# Altium project MdFOC.PrjPcb
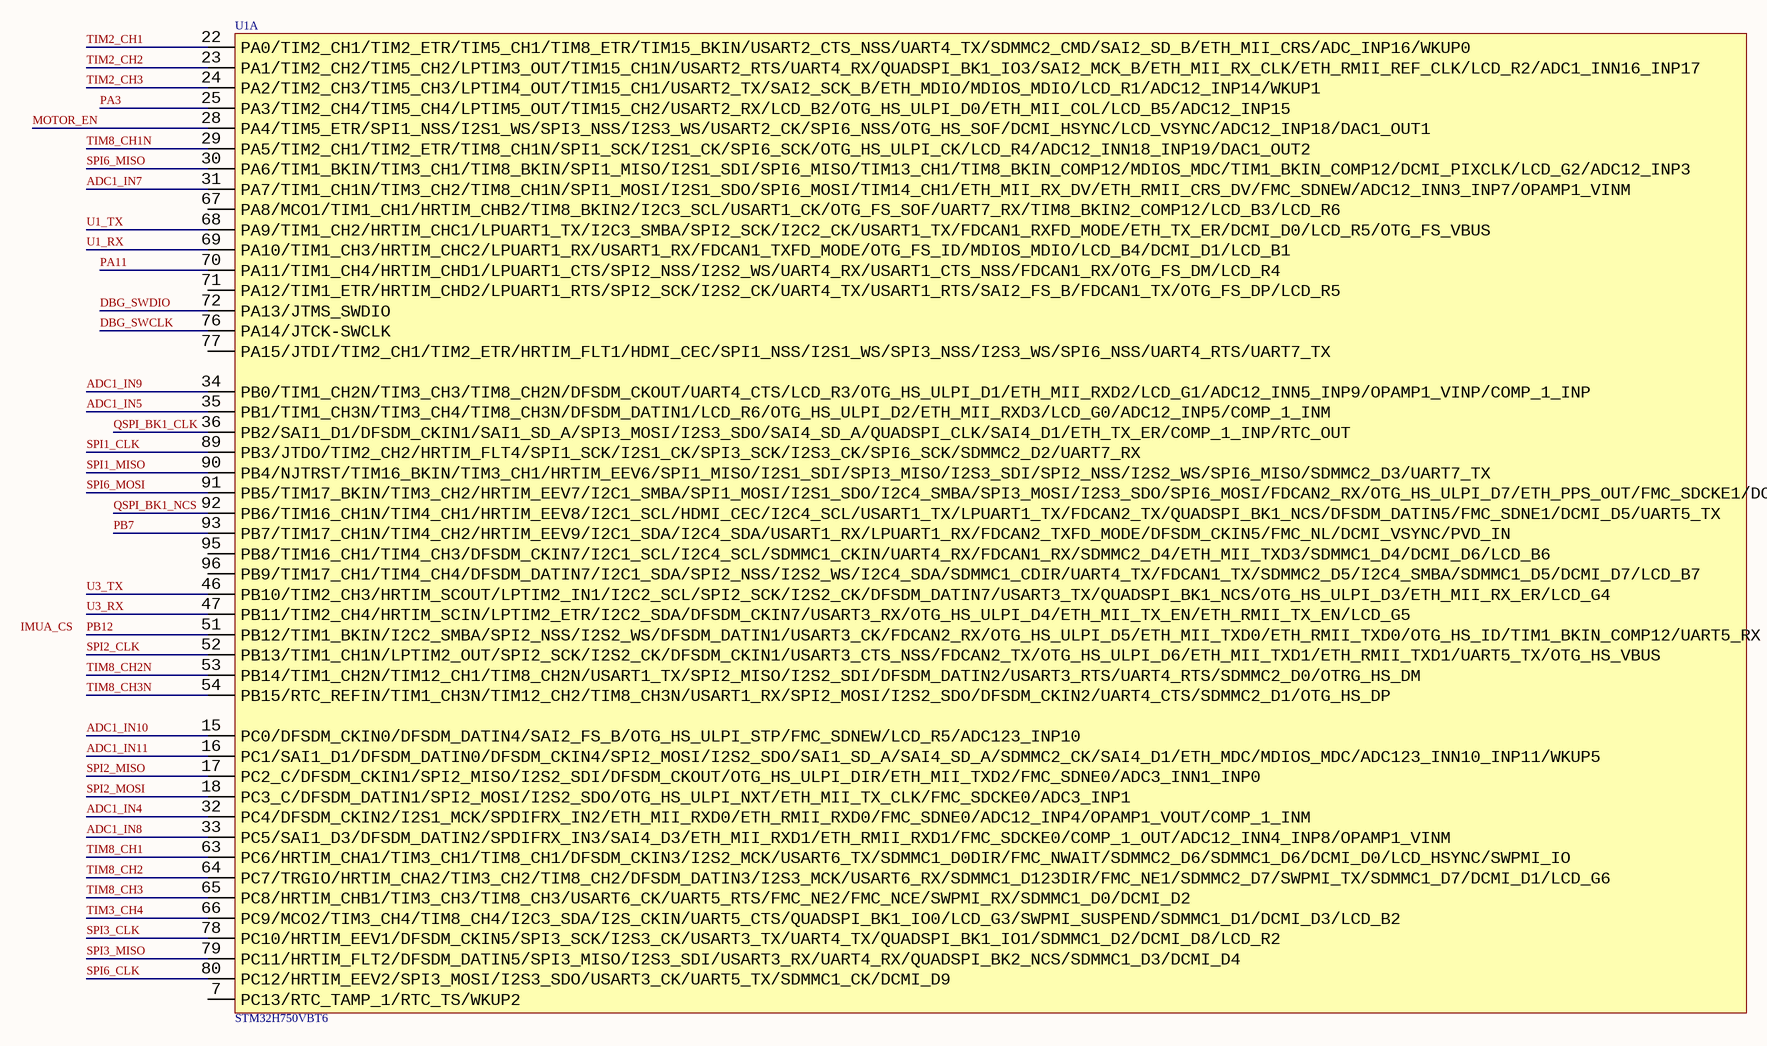
[diagram p0: MCU_A.SchDoc]
5 sheets, 195 parts. Net scope: global (net labels, ports and power ports of the same name join across sheets).
Board file: MdFOC.PcbDoc
Sheets:
  MCU_A.SchDoc
  MCU_B.SchDoc
  Motor.SchDoc
  Power.SchDoc
  Peripheral.SchDoc

## Sheet MCU_A.SchDoc
size A3; SheetNumber: 1; SheetTotal: 5

### Parts
U1  STM32H750VBT6  [LQFP100 14x14_L]  (part A of 3)

### Nets
ADC1_IN4: U1.32(PC4/DFSDM_CKIN2/I2S1_MCK/SPDIFRX_IN2/ETH_MII_RXD0/ETH_RMII_RXD0/FMC_SDNE0/ADC12_INP4/OPAMP1_VOUT/COMP_1_INM)  [project net 2A_ISENS]
ADC1_IN5: U1.35(PB1/TIM1_CH3N/TIM3_CH4/TIM8_CH3N/DFSDM_DATIN1/LCD_R6/OTG_HS_ULPI_D2/ETH_MII_RXD3/LCD_G0/ADC12_INP5/COMP_1_INM)  [project net 1A_ISENS]
ADC1_IN7: U1.31(PA7/TIM1_CH1N/TIM3_CH2/TIM8_CH1N/SPI1_MOSI/I2S1_SDO/SPI6_MOSI/TIM14_CH1/ETH_MII_RX_DV/ETH_RMII_CRS_DV/FMC_SDNEW/ADC12_INN3_INP7/OPAMP1_VINM)  [project net 3A_ISENS]
ADC1_IN8: U1.33(PC5/SAI1_D3/DFSDM_DATIN2/SPDIFRX_IN3/SAI4_D3/ETH_MII_RXD1/ETH_RMII_RXD1/FMC_SDCKE0/COMP_1_OUT/ADC12_INN4_INP8/OPAMP1_VINM)  [project net 2B_ISENS]
ADC1_IN9: U1.34(PB0/TIM1_CH2N/TIM3_CH3/TIM8_CH2N/DFSDM_CKOUT/UART4_CTS/LCD_R3/OTG_HS_ULPI_D1/ETH_MII_RXD2/LCD_G1/ADC12_INN5_INP9/OPAMP1_VINP/COMP_1_INP)  [project net 1B_ISENS]
ADC1_IN10: U1.15(PC0/DFSDM_CKIN0/DFSDM_DATIN4/SAI2_FS_B/OTG_HS_ULPI_STP/FMC_SDNEW/LCD_R5/ADC123_INP10)  [project net 3B_ISENS]
ADC1_IN11: U1.16(PC1/SAI1_D1/DFSDM_DATIN0/DFSDM_CKIN4/SPI2_MOSI/I2S2_SDO/SAI1_SD_A/SAI4_SD_A/SDMMC2_CK/SAI4_D1/ETH_MDC/MDIOS_MDC/ADC123_INN10_INP11/WKUP5)
DBG_SWCLK: U1.76(PA14/JTCK-SWCLK)
DBG_SWDIO: U1.72(PA13/JTMS_SWDIO)
MOTOR_EN: U1.28(PA4/TIM5_ETR/SPI1_NSS/I2S1_WS/SPI3_NSS/I2S3_WS/USART2_CK/SPI6_NSS/OTG_HS_SOF/DCMI_HSYNC/LCD_VSYNC/ADC12_INP18/DAC1_OUT1)
PA3: U1.25(PA3/TIM2_CH4/TIM5_CH4/LPTIM5_OUT/TIM15_CH2/USART2_RX/LCD_B2/OTG_HS_ULPI_D0/ETH_MII_COL/LCD_B5/ADC12_INP15)  [project net EC2_CS]
PA11: U1.70(PA11/TIM1_CH4/HRTIM_CHD1/LPUART1_CTS/SPI2_NSS/I2S2_WS/UART4_RX/USART1_CTS_NSS/FDCAN1_RX/OTG_FS_DM/LCD_R4)
PB7: U1.93(PB7/TIM17_CH1N/TIM4_CH2/HRTIM_EEV9/I2C1_SDA/I2C4_SDA/USART1_RX/LPUART1_RX/FDCAN2_TXFD_MODE/DFSDM_CKIN5/FMC_NL/DCMI_VSYNC/PVD_IN)
PB12: U1.51(PB12/TIM1_BKIN/I2C2_SMBA/SPI2_NSS/I2S2_WS/DFSDM_DATIN1/USART3_CK/FDCAN2_RX/OTG_HS_ULPI_D5/ETH_MII_TXD0/ETH_RMII_TXD0/OTG_HS_ID/TIM1_BKIN_COMP12/UART5_RX)  [project net IMU_CS]
QSPI_BK1_CLK: U1.36(PB2/SAI1_D1/DFSDM_CKIN1/SAI1_SD_A/SPI3_MOSI/I2S3_SDO/SAI4_SD_A/QUADSPI_CLK/SAI4_D1/ETH_TX_ER/COMP_1_INP/RTC_OUT)
QSPI_BK1_NCS: U1.92(PB6/TIM16_CH1N/TIM4_CH1/HRTIM_EEV8/I2C1_SCL/HDMI_CEC/I2C4_SCL/USART1_TX/LPUART1_TX/FDCAN2_TX/QUADSPI_BK1_NCS/DFSDM_DATIN5/FMC_SDNE1/DCMI_D5/UART5_TX)
SPI1_CLK: U1.89(PB3/JTDO/TIM2_CH2/HRTIM_FLT4/SPI1_SCK/I2S1_CK/SPI3_SCK/I2S3_CK/SPI6_SCK/SDMMC2_D2/UART7_RX)  [project net EC1_CLK]
SPI1_MISO: U1.90(PB4/NJTRST/TIM16_BKIN/TIM3_CH1/HRTIM_EEV6/SPI1_MISO/I2S1_SDI/SPI3_MISO/I2S3_SDI/SPI2_NSS/I2S2_WS/SPI6_MISO/SDMMC2_D3/UART7_TX)  [project net EC1_MISO]
SPI2_CLK: U1.52(PB13/TIM1_CH1N/LPTIM2_OUT/SPI2_SCK/I2S2_CK/DFSDM_CKIN1/USART3_CTS_NSS/FDCAN2_TX/OTG_HS_ULPI_D6/ETH_MII_TXD1/ETH_RMII_TXD1/UART5_TX/OTG_HS_VBUS)  [project net IMU_CLK]
SPI2_MISO: U1.17(PC2_C/DFSDM_CKIN1/SPI2_MISO/I2S2_SDI/DFSDM_CKOUT/OTG_HS_ULPI_DIR/ETH_MII_TXD2/FMC_SDNE0/ADC3_INN1_INP0)  [project net IMU_MISO]
SPI2_MOSI: U1.18(PC3_C/DFSDM_DATIN1/SPI2_MOSI/I2S2_SDO/OTG_HS_ULPI_NXT/ETH_MII_TX_CLK/FMC_SDCKE0/ADC3_INP1)  [project net IMU_MOSI]
SPI3_CLK: U1.78(PC10/HRTIM_EEV1/DFSDM_CKIN5/SPI3_SCK/I2S3_CK/USART3_TX/UART4_TX/QUADSPI_BK1_IO1/SDMMC1_D2/DCMI_D8/LCD_R2)  [project net SF_CLK]
SPI3_MISO: U1.79(PC11/HRTIM_FLT2/DFSDM_DATIN5/SPI3_MISO/I2S3_SDI/USART3_RX/UART4_RX/QUADSPI_BK2_NCS/SDMMC1_D3/DCMI_D4)  [project net SF_MISO]
SPI6_CLK: U1.80(PC12/HRTIM_EEV2/SPI3_MOSI/I2S3_SDO/USART3_CK/UART5_TX/SDMMC1_CK/DCMI_D9)
SPI6_MISO: U1.30(PA6/TIM1_BKIN/TIM3_CH1/TIM8_BKIN/SPI1_MISO/I2S1_SDI/SPI6_MISO/TIM13_CH1/TIM8_BKIN_COMP12/MDIOS_MDC/TIM1_BKIN_COMP12/DCMI_PIXCLK/LCD_G2/ADC12_INP3)
SPI6_MOSI: U1.91(PB5/TIM17_BKIN/TIM3_CH2/HRTIM_EEV7/I2C1_SMBA/SPI1_MOSI/I2S1_SDO/I2C4_SMBA/SPI3_MOSI/I2S3_SDO/SPI6_MOSI/FDCAN2_RX/OTG_HS_ULPI_D7/ETH_PPS_OUT/FMC_SDCKE1/DCMI_D10/UART5_RX)
TIM2_CH1: U1.22(PA0/TIM2_CH1/TIM2_ETR/TIM5_CH1/TIM8_ETR/TIM15_BKIN/USART2_CTS_NSS/UART4_TX/SDMMC2_CMD/SAI2_SD_B/ETH_MII_CRS/ADC_INP16/WKUP0)  [project net M3_PWMA]
TIM2_CH2: U1.23(PA1/TIM2_CH2/TIM5_CH2/LPTIM3_OUT/TIM15_CH1N/USART2_RTS/UART4_RX/QUADSPI_BK1_IO3/SAI2_MCK_B/ETH_MII_RX_CLK/ETH_RMII_REF_CLK/LCD_R2/ADC1_INN16_INP17)  [project net M3_PWMB]
TIM2_CH3: U1.24(PA2/TIM2_CH3/TIM5_CH3/LPTIM4_OUT/TIM15_CH1/USART2_TX/SAI2_SCK_B/ETH_MDIO/MDIOS_MDIO/LCD_R1/ADC12_INP14/WKUP1)  [project net M3_PWMC]
TIM3_CH4: U1.66(PC9/MCO2/TIM3_CH4/TIM8_CH4/I2C3_SDA/I2S_CKIN/UART5_CTS/QUADSPI_BK1_IO0/LCD_G3/SWPMI_SUSPEND/SDMMC1_D1/DCMI_D3/LCD_B2)  [project net BEEP_PWM]
TIM8_CH1: U1.63(PC6/HRTIM_CHA1/TIM3_CH1/TIM8_CH1/DFSDM_CKIN3/I2S2_MCK/USART6_TX/SDMMC1_D0DIR/FMC_NWAIT/SDMMC2_D6/SDMMC1_D6/DCMI_D0/LCD_HSYNC/SWPMI_IO)  [project net M1_PWMA]
TIM8_CH1N: U1.29(PA5/TIM2_CH1/TIM2_ETR/TIM8_CH1N/SPI1_SCK/I2S1_CK/SPI6_SCK/OTG_HS_ULPI_CK/LCD_R4/ADC12_INN18_INP19/DAC1_OUT2)  [project net M1_PWMA_N]
TIM8_CH2: U1.64(PC7/TRGIO/HRTIM_CHA2/TIM3_CH2/TIM8_CH2/DFSDM_DATIN3/I2S3_MCK/USART6_RX/SDMMC1_D123DIR/FMC_NE1/SDMMC2_D7/SWPMI_TX/SDMMC1_D7/DCMI_D1/LCD_G6)  [project net M1_PWMB]
TIM8_CH2N: U1.53(PB14/TIM1_CH2N/TIM12_CH1/TIM8_CH2N/USART1_TX/SPI2_MISO/I2S2_SDI/DFSDM_DATIN2/USART3_RTS/UART4_RTS/SDMMC2_D0/OTRG_HS_DM)  [project net M1_PWMB_N]
TIM8_CH3: U1.65(PC8/HRTIM_CHB1/TIM3_CH3/TIM8_CH3/USART6_CK/UART5_RTS/FMC_NE2/FMC_NCE/SWPMI_RX/SDMMC1_D0/DCMI_D2)  [project net M1_PWMC]
TIM8_CH3N: U1.54(PB15/RTC_REFIN/TIM1_CH3N/TIM12_CH2/TIM8_CH3N/USART1_RX/SPI2_MOSI/I2S2_SDO/DFSDM_CKIN2/UART4_CTS/SDMMC2_D1/OTG_HS_DP)  [project net M1_PWMC_N]
U1_RX: U1.69(PA10/TIM1_CH3/HRTIM_CHC2/LPUART1_RX/USART1_RX/FDCAN1_TXFD_MODE/OTG_FS_ID/MDIOS_MDIO/LCD_B4/DCMI_D1/LCD_B1)
U1_TX: U1.68(PA9/TIM1_CH2/HRTIM_CHC1/LPUART1_TX/I2C3_SMBA/SPI2_SCK/I2C2_CK/USART1_TX/FDCAN1_RXFD_MODE/ETH_TX_ER/DCMI_D0/LCD_R5/OTG_FS_VBUS)
U3_RX: U1.47(PB11/TIM2_CH4/HRTIM_SCIN/LPTIM2_ETR/I2C2_SDA/DFSDM_CKIN7/USART3_RX/OTG_HS_ULPI_D4/ETH_MII_TX_EN/ETH_RMII_TX_EN/LCD_G5)
U3_TX: U1.46(PB10/TIM2_CH3/HRTIM_SCOUT/LPTIM2_IN1/I2C2_SCL/SPI2_SCK/I2S2_CK/DFSDM_DATIN7/USART3_TX/QUADSPI_BK1_NCS/OTG_HS_ULPI_D3/ETH_MII_RX_ER/LCD_G4)

Not connected (* = marked no-connect by the designer): U1 7(PC13/RTC_TAMP_1/RTC_TS/WKUP2) 67(PA8/MCO1/TIM1_CH1/HRTIM_CHB2/TIM8_BKIN2/I2C3_SCL/USART1_CK/OTG_FS_SOF/UART7_RX/TIM8_BKIN2_COMP12/LCD_B3/LCD_R6) 71(PA12/TIM1_ETR/HRTIM_CHD2/LPUART1_RTS/SPI2_SCK/I2S2_CK/UART4_TX/USART1_RTS/SAI2_FS_B/FDCAN1_TX/OTG_FS_DP/LCD_R5) 77(PA15/JTDI/TIM2_CH1/TIM2_ETR/HRTIM_FLT1/HDMI_CEC/SPI1_NSS/I2S1_WS/SPI3_NSS/I2S3_WS/SPI6_NSS/UART4_RTS/UART7_TX) 95(PB8/TIM16_CH1/TIM4_CH3/DFSDM_CKIN7/I2C1_SCL/I2C4_SCL/SDMMC1_CKIN/UART4_RX/FDCAN1_RX/SDMMC2_D4/ETH_MII_TXD3/SDMMC1_D4/DCMI_D6/LCD_B6) 96(PB9/TIM17_CH1/TIM4_CH4/DFSDM_DATIN7/I2C1_SDA/SPI2_NSS/I2S2_WS/I2C4_SDA/SDMMC1_CDIR/UART4_TX/FDCAN1_TX/SDMMC2_D5/I2C4_SMBA/SDMMC1_D5/DCMI_D7/LCD_B7)

### Notes on the sheet
- IMUA_CS

## Sheet MCU_B.SchDoc
size A3; SheetNumber: 2; SheetTotal: 5
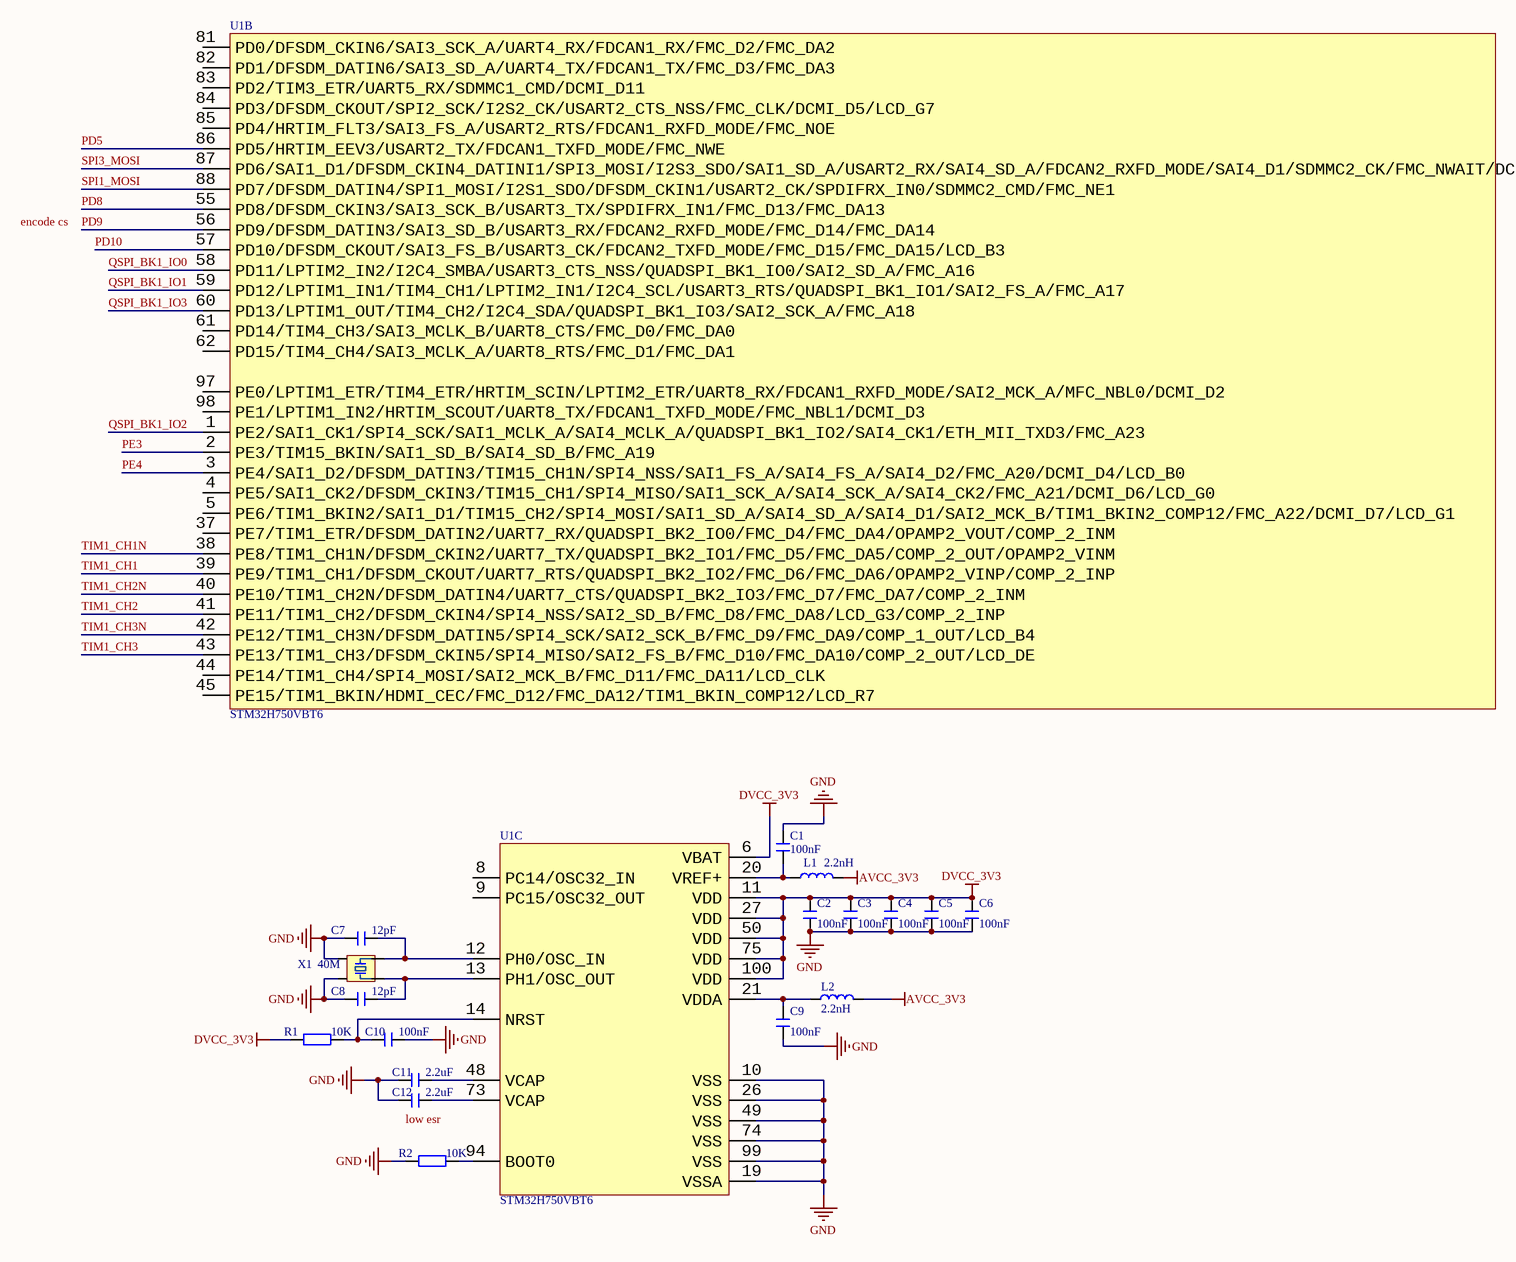
[diagram p1: MCU_B.SchDoc]

### Parts
C1  100nF  [C 0402_L]
C2  100nF  [C 0402_L]
C3  100nF  [C 0402_L]
C4  100nF  [C 0402_L]
C5  100nF  [C 0402_L]
C6  100nF  [C 0402_L]
C7  12pF  [C 0402_L]
C8  12pF  [C 0402_L]
C9  100nF  [C 0402_L]
C10  100nF  [C 0402_L]
C11  2.2uF  [C 0402_L]
C12  2.2uF  [C 0402_L]
L1  2.2nH  [L 0402]
L2  2.2nH  [L 0402]
R1  10K  [R 0402_L]
R2  10K  [R 0402_L]
U1  STM32H750VBT6  [LQFP100 14x14_L]  (parts B,C of 3)
X1  40M  [OSC 2016-4P]

### Nets
AVCC_3V3: L1.2 L2.2
DVCC_3V3: C2.2 C3.2 C4.2 C5.2 C6.2 R1.1 U1.6(VBAT) U1.11(VDD) U1.27(VDD) U1.50(VDD) U1.75(VDD) U1.100(VDD)
GND: C1.2 C2.1 C3.1 C4.1 C5.1 C6.1 C7.1 C8.1 C9.1 C10.2 C11.1 C12.1 R2.1 U1.10(VSS) U1.19(VSSA) U1.26(VSS) U1.49(VSS) U1.74(VSS) U1.99(VSS) X1.2 X1.4
PD5: U1.86(PD5/HRTIM_EEV3/USART2_TX/FDCAN1_TXFD_MODE/FMC_NWE)
PD8: U1.55(PD8/DFSDM_CKIN3/SAI3_SCK_B/USART3_TX/SPDIFRX_IN1/FMC_D13/FMC_DA13)  [project net IMUB_CS]
PD9: U1.56(PD9/DFSDM_DATIN3/SAI3_SD_B/USART3_RX/FDCAN2_RXFD_MODE/FMC_D14/FMC_DA14)  [project net EC1_CS]
PD10: U1.57(PD10/DFSDM_CKOUT/SAI3_FS_B/USART3_CK/FDCAN2_TXFD_MODE/FMC_D15/FMC_DA15/LCD_B3)  [project net EC3_CS]
PE3: U1.2(PE3/TIM15_BKIN/SAI1_SD_B/SAI4_SD_B/FMC_A19)
PE4: U1.3(PE4/SAI1_D2/DFSDM_DATIN3/TIM15_CH1N/SPI4_NSS/SAI1_FS_A/SAI4_FS_A/SAI4_D2/FMC_A20/DCMI_D4/LCD_B0)
QSPI_BK1_IO0: U1.58(PD11/LPTIM2_IN2/I2C4_SMBA/USART3_CTS_NSS/QUADSPI_BK1_IO0/SAI2_SD_A/FMC_A16)
QSPI_BK1_IO1: U1.59(PD12/LPTIM1_IN1/TIM4_CH1/LPTIM2_IN1/I2C4_SCL/USART3_RTS/QUADSPI_BK1_IO1/SAI2_FS_A/FMC_A17)
QSPI_BK1_IO2: U1.1(PE2/SAI1_CK1/SPI4_SCK/SAI1_MCLK_A/SAI4_MCLK_A/QUADSPI_BK1_IO2/SAI4_CK1/ETH_MII_TXD3/FMC_A23)
QSPI_BK1_IO3: U1.60(PD13/LPTIM1_OUT/TIM4_CH2/I2C4_SDA/QUADSPI_BK1_IO3/SAI2_SCK_A/FMC_A18)
SPI1_MOSI: U1.88(PD7/DFSDM_DATIN4/SPI1_MOSI/I2S1_SDO/DFSDM_CKIN1/USART2_CK/SPDIFRX_IN0/SDMMC2_CMD/FMC_NE1)  [project net EC1_MOSI]
SPI3_MOSI: U1.87(PD6/SAI1_D1/DFSDM_CKIN4_DATINI1/SPI3_MOSI/I2S3_SDO/SAI1_SD_A/USART2_RX/SAI4_SD_A/FDCAN2_RXFD_MODE/SAI4_D1/SDMMC2_CK/FMC_NWAIT/DCMI_D10/LCD_B2)  [project net SF_MOSI]
TIM1_CH1: U1.39(PE9/TIM1_CH1/DFSDM_CKOUT/UART7_RTS/QUADSPI_BK2_IO2/FMC_D6/FMC_DA6/OPAMP2_VINP/COMP_2_INP)  [project net M2_PWMA]
TIM1_CH1N: U1.38(PE8/TIM1_CH1N/DFSDM_CKIN2/UART7_TX/QUADSPI_BK2_IO1/FMC_D5/FMC_DA5/COMP_2_OUT/OPAMP2_VINM)  [project net M2_PWMA_N]
TIM1_CH2: U1.41(PE11/TIM1_CH2/DFSDM_CKIN4/SPI4_NSS/SAI2_SD_B/FMC_D8/FMC_DA8/LCD_G3/COMP_2_INP)  [project net M2_PWMB]
TIM1_CH2N: U1.40(PE10/TIM1_CH2N/DFSDM_DATIN4/UART7_CTS/QUADSPI_BK2_IO3/FMC_D7/FMC_DA7/COMP_2_INM)  [project net M2_PWMB_N]
TIM1_CH3: U1.43(PE13/TIM1_CH3/DFSDM_CKIN5/SPI4_MISO/SAI2_FS_B/FMC_D10/FMC_DA10/COMP_2_OUT/LCD_DE)  [project net M2_PWMC]
TIM1_CH3N: U1.42(PE12/TIM1_CH3N/DFSDM_DATIN5/SPI4_SCK/SAI2_SCK_B/FMC_D9/FMC_DA9/COMP_1_OUT/LCD_B4)  [project net M2_PWMC_N]
NetC1_1: C1.1 L1.1 U1.20(VREF+)
NetC7_2: C7.2 U1.12(PH0/OSC_IN) X1.1
NetC8_2: C8.2 U1.13(PH1/OSC_OUT) X1.3
NetC9_2: C9.2 L2.1 U1.21(VDDA)
NetC10_1: C10.1 R1.2 U1.14(NRST)
NetC11_2: C11.2 U1.48(VCAP)
NetC12_2: C12.2 U1.73(VCAP)
NetR2_2: R2.2 U1.94(BOOT0)

Not connected (* = marked no-connect by the designer): U1 4(PE5/SAI1_CK2/DFSDM_CKIN3/TIM15_CH1/SPI4_MISO/SAI1_SCK_A/SAI4_SCK_A/SAI4_CK2/FMC_A21/DCMI_D6/LCD_G0) 5(PE6/TIM1_BKIN2/SAI1_D1/TIM15_CH2/SPI4_MOSI/SAI1_SD_A/SAI4_SD_A/SAI4_D1/SAI2_MCK_B/TIM1_BKIN2_COMP12/FMC_A22/DCMI_D7/LCD_G1) 8(PC14/OSC32_IN) 9(PC15/OSC32_OUT) 37(PE7/TIM1_ETR/DFSDM_DATIN2/UART7_RX/QUADSPI_BK2_IO0/FMC_D4/FMC_DA4/OPAMP2_VOUT/COMP_2_INM) 44(PE14/TIM1_CH4/SPI4_MOSI/SAI2_MCK_B/FMC_D11/FMC_DA11/LCD_CLK) 45(PE15/TIM1_BKIN/HDMI_CEC/FMC_D12/FMC_DA12/TIM1_BKIN_COMP12/LCD_R7) 61(PD14/TIM4_CH3/SAI3_MCLK_B/UART8_CTS/FMC_D0/FMC_DA0) 62(PD15/TIM4_CH4/SAI3_MCLK_A/UART8_RTS/FMC_D1/FMC_DA1) 81(PD0/DFSDM_CKIN6/SAI3_SCK_A/UART4_RX/FDCAN1_RX/FMC_D2/FMC_DA2) 82(PD1/DFSDM_DATIN6/SAI3_SD_A/UART4_TX/FDCAN1_TX/FMC_D3/FMC_DA3) 83(PD2/TIM3_ETR/UART5_RX/SDMMC1_CMD/DCMI_D11) 84(PD3/DFSDM_CKOUT/SPI2_SCK/I2S2_CK/USART2_CTS_NSS/FMC_CLK/DCMI_D5/LCD_G7) 85(PD4/HRTIM_FLT3/SAI3_FS_A/USART2_RTS/FDCAN1_RXFD_MODE/FMC_NOE) 97(PE0/LPTIM1_ETR/TIM4_ETR/HRTIM_SCIN/LPTIM2_ETR/UART8_RX/FDCAN1_RXFD_MODE/SAI2_MCK_A/MFC_NBL0/DCMI_D2) 98(PE1/LPTIM1_IN2/HRTIM_SCOUT/UART8_TX/FDCAN1_TXFD_MODE/FMC_NBL1/DCMI_D3)

### Notes on the sheet
- encode cs
- (near C12) low esr

### Library data of the parts
C1-C12 = C: 无极性贴片电容; 版权归属: 源创客; BOM名称: 无极性贴片电容; 学习资源: www.ooocke.com
L1 L2 = L: 小功率贴片电感; 版权归属: 源创客; BOM名称: 小功率贴片电感; 学习资源: www.ooocke.com
R1 R2 = R: 贴片电阻; 版权归属: 源创客; BOM名称: 贴片电阻; 学习资源: www.ooocke.com
X1 = XTAL-4P: 4脚无源晶振; 版权归属: 源创客; BOM名称: 4脚无源晶振; 学习资源: www.ooocke.com

## Sheet Motor.SchDoc
size A3; SheetNumber: 3; SheetTotal: 5
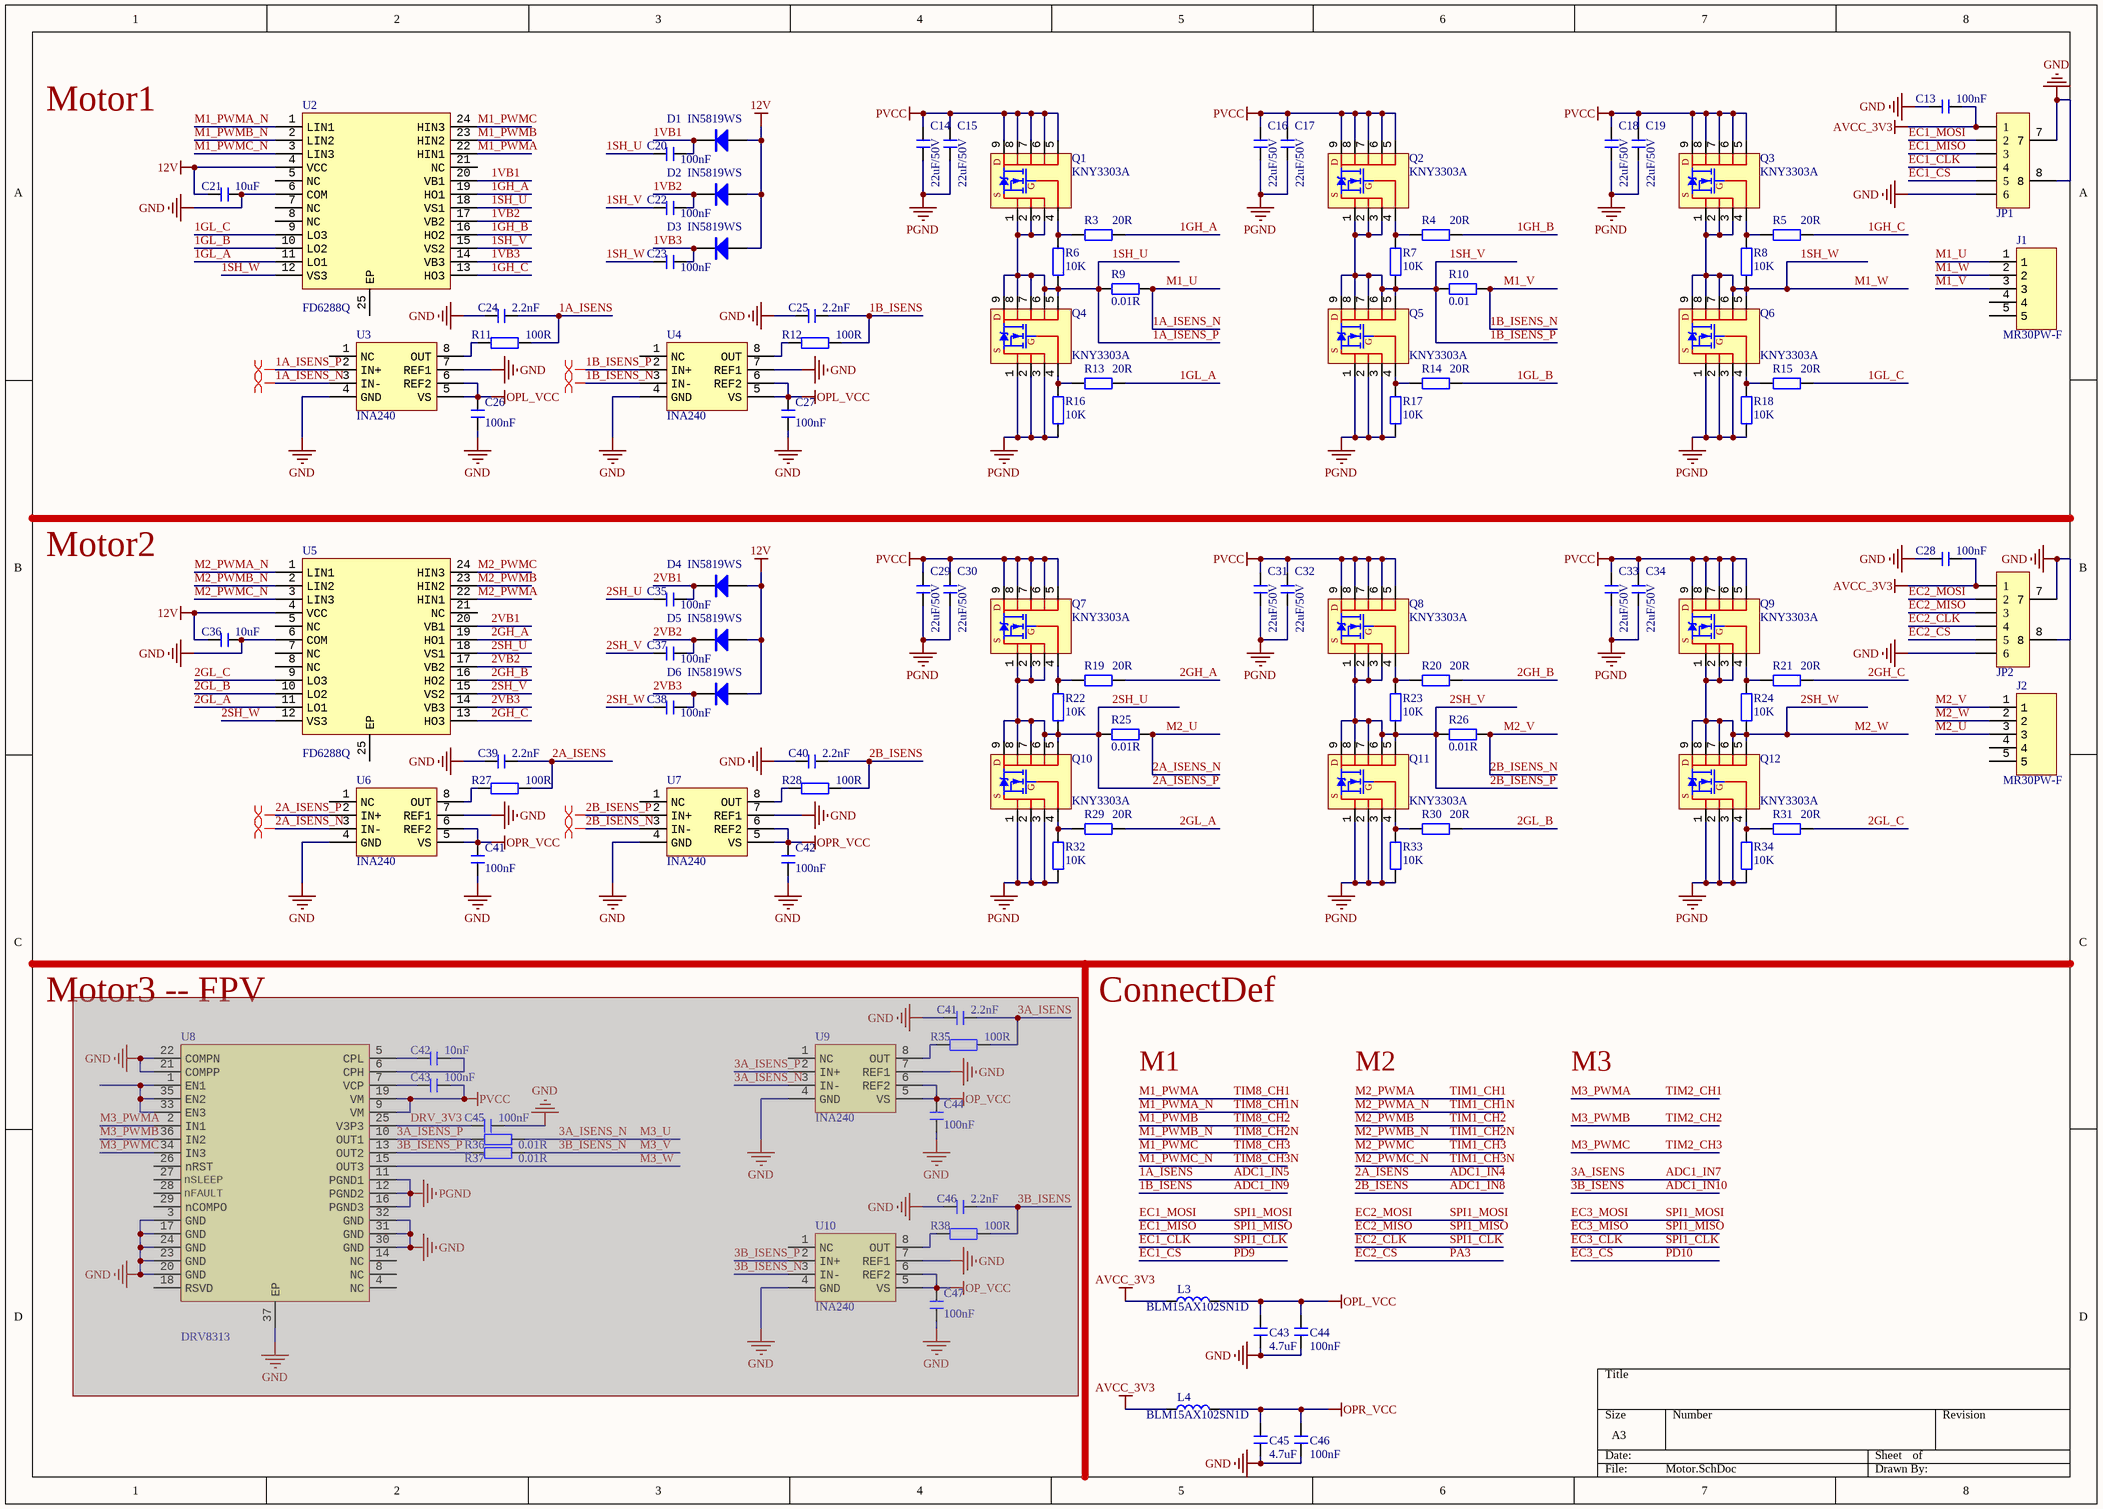
[diagram p2: Motor.SchDoc]

### Parts
(Parts that share a designator on the sheet are numbered #1, #2 ... from top to bottom, then left to right.)
C13  100nF  [C 0402_L]
C14  22uF/50V  [C 1206_L]
C15  22uF/50V  [C 1206_L]
C16  22uF/50V  [C 1206_L]
C17  22uF/50V  [C 1206_L]
C18  22uF/50V  [C 1206_L]
C19  22uF/50V  [C 1206_L]
C20  100nF  [C 0402_L]
C21  10uF  [C 0603_L]
C22  100nF  [C 0402_L]
C23  100nF  [C 0402_L]
C24  2.2nF  [C 0402_L]
C25  2.2nF  [C 0402_L]
C26  100nF  [C 0402_L]
C27  100nF  [C 0402_L]
C28  100nF  [C 0402_L]
C29  22uF/50V  [C 1206_L]
C30  22uF/50V  [C 1206_L]
C31  22uF/50V  [C 1206_L]
C32  22uF/50V  [C 1206_L]
C33  22uF/50V  [C 1206_L]
C34  22uF/50V  [C 1206_L]
C35  100nF  [C 0402_L]
C36  10uF  [C 0603_L]
C37  100nF  [C 0402_L]
C38  100nF  [C 0402_L]
C39  2.2nF  [C 0402_L]
C40  2.2nF  [C 0402_L]
C41#1  100nF  [C 0402_L]
C41#2  2.2nF  [C 0402_L]  (masked out: inside a compile mask, not in the netlist)
C42#1  100nF  [C 0402_L]
C42#2  10nF  [C 0402_L]  (masked out: inside a compile mask, not in the netlist)
C43#1  100nF  [C 0402_L]  (masked out: inside a compile mask, not in the netlist)
C43#2  4.7uF  [C 0402_L]
C44#1  100nF  [C 0402_L]  (masked out: inside a compile mask, not in the netlist)
C44#2  100nF  [C 0402_L]
C45#1  100nF  [C 0402_L]  (masked out: inside a compile mask, not in the netlist)
C45#2  4.7uF  [C 0402_L]
C46#1  2.2nF  [C 0402_L]  (masked out: inside a compile mask, not in the netlist)
C46#2  100nF  [C 0402_L]
C47#1  100nF  [C 0402_L]  (masked out: inside a compile mask, not in the netlist)
D1  IN5819WS  [SOD-323]
D2  IN5819WS  [SOD-323]
D3  IN5819WS  [SOD-323]
D4  IN5819WS  [SOD-323]
D5  IN5819WS  [SOD-323]
D6  IN5819WS  [SOD-323]
J1  MR30PW-F  [MR30PW_F]
J2  MR30PW-F  [MR30PW_F]
JP1  HDR-1X6  [GH1.25-WS-6P]  (value not drawn)
JP2  HDR-1X6  [GH1.25-WS-6P]  (value not drawn)
L3  BLM15AX102SN1D  [L 0402]
L4  BLM15AX102SN1D  [L 0402]
Q1  KNY3303A  [PDFN-8(5.8x4.9)]
Q2  KNY3303A  [PDFN-8(5.8x4.9)]
Q3  KNY3303A  [PDFN-8(5.8x4.9)]
Q4  KNY3303A  [PDFN-8(5.8x4.9)]
Q5  KNY3303A  [PDFN-8(5.8x4.9)]
Q6  KNY3303A  [PDFN-8(5.8x4.9)]
Q7  KNY3303A  [PDFN-8(5.8x4.9)]
Q8  KNY3303A  [PDFN-8(5.8x4.9)]
Q9  KNY3303A  [PDFN-8(5.8x4.9)]
Q10  KNY3303A  [PDFN-8(5.8x4.9)]
Q11  KNY3303A  [PDFN-8(5.8x4.9)]
Q12  KNY3303A  [PDFN-8(5.8x4.9)]
R3  20R  [R 0402_L]
R4  20R  [R 0402_L]
R5  20R  [R 0402_L]
R6  10K  [R 0402_L]
R7  10K  [R 0402_L]
R8  10K  [R 0402_L]
R9  0.01R  [R 2512_L]
R10  0.01  [R 2512_L]
R11  100R  [R 0402_L]
R12  100R  [R 0402_L]
R13  20R  [R 0402_L]
R14  20R  [R 0402_L]
R15  20R  [R 0402_L]
R16  10K  [R 0402_L]
R17  10K  [R 0402_L]
R18  10K  [R 0402_L]
R19  20R  [R 0402_L]
R20  20R  [R 0402_L]
R21  20R  [R 0402_L]
R22  10K  [R 0402_L]
R23  10K  [R 0402_L]
R24  10K  [R 0402_L]
R25  0.01R  [R 2512_L]
R26  0.01R  [R 2512_L]
R27  100R  [R 0402_L]
R28  100R  [R 0402_L]
R29  20R  [R 0402_L]
R30  20R  [R 0402_L]
R31  20R  [R 0402_L]
R32  10K  [R 0402_L]
R33  10K  [R 0402_L]
R34  10K  [R 0402_L]
R35#1  100R  [R 0402_L]  (masked out: inside a compile mask, not in the netlist)
R36#1  0.01R  [RI 1206]  (masked out: inside a compile mask, not in the netlist)
R37#1  0.01R  [RI 1206]  (masked out: inside a compile mask, not in the netlist)
R38#1  100R  [R 0402_L]  (masked out: inside a compile mask, not in the netlist)
U2  FD6288Q  [QFN24 4x4_L]
U3  INA240  [SSOP8_L]
U4  INA240  [SSOP8_L]
U5  FD6288Q  [QFN24 4x4_L]
U6  INA240  [SSOP8_L]
U7  INA240  [SSOP8_L]
U8#1  DRV8313  [VQFN-36-6X6]  (masked out: inside a compile mask, not in the netlist)
U9#1  INA240  [SSOP8_L]  (masked out: inside a compile mask, not in the netlist)
U10#1  INA240  [SSOP8_L]  (masked out: inside a compile mask, not in the netlist)

### Nets
12V: C21.1 C36.1 D1.2(K) D2.2(K) D3.2(K) D4.2(K) D5.2(K) D6.2(K) U2.4(VCC) U5.4(VCC)
AVCC_3V3: C13.2 C28.2 JP1.1 JP2.1 L3.1 L4.1
GND: C13.1 C21.2 C24.1 C25.1 C26.1 C27.1 C28.1 C36.2 C39.1 C40.1 C41#1.1 C42#1.1 C43#2.1 C44#2.1 C45#2.1 C46#2.1 JP1.6 JP1.7 JP1.8 JP2.6 JP2.7 JP2.8 U2.6(COM) U3.4(GND) U3.7(REF1) U4.4(GND) U4.7(REF1) U5.6(COM) U6.4(GND) U6.7(REF1) U7.4(GND) U7.7(REF1)
OPL_VCC: C26.2 C27.2 C43#2.2 C44#2.2 L3.2 U3.5(VS) U3.6(REF2) U4.5(VS) U4.6(REF2)
OPR_VCC: C41#1.2 C42#1.2 C45#2.2 C46#2.2 L4.2 U6.5(VS) U6.6(REF2) U7.5(VS) U7.6(REF2)
PGND: C14.1 C15.1 C16.1 C17.1 C18.1 C19.1 C29.1 C30.1 C31.1 C32.1 C33.1 C34.1 Q4.1(S) Q4.2(S) Q4.3(S) Q5.1(S) Q5.2(S) Q5.3(S) Q6.1(S) Q6.2(S) Q6.3(S) Q10.1(S) Q10.2(S) Q10.3(S) Q11.1(S) Q11.2(S) Q11.3(S) Q12.1(S) Q12.2(S) Q12.3(S) R16.1 R17.1 R18.1 R32.1 R33.1 R34.1
PVCC: C14.2 C15.2 C16.2 C17.2 C18.2 C19.2 C29.2 C30.2 C31.2 C32.2 C33.2 C34.2 Q1.5(D) Q1.6(D) Q1.7(D) Q1.8(D) Q1.9(D) Q2.5(D) Q2.6(D) Q2.7(D) Q2.8(D) Q2.9(D) Q3.5(D) Q3.6(D) Q3.7(D) Q3.8(D) Q3.9(D) Q7.5(D) Q7.6(D) Q7.7(D) Q7.8(D) Q7.9(D) Q8.5(D) Q8.6(D) Q8.7(D) Q8.8(D) Q8.9(D) Q9.5(D) Q9.6(D) Q9.7(D) Q9.8(D) Q9.9(D)
1A_ISENS: C24.2 R11.2  [also labelled ADC1_IN5]
1A_ISENS_N: J1.1 R9.2 U3.3(IN-)  [also labelled M1_U]
1A_ISENS_P: C20.1 Q1.1(S) Q1.2(S) Q1.3(S) Q4.5(D) Q4.6(D) Q4.7(D) Q4.8(D) Q4.9(D) R6.1 R9.1 U2.18(VS1) U3.2(IN+)  [also labelled 1SH_U]
1B_ISENS: C25.2 R12.2  [also labelled ADC1_IN9]
1B_ISENS_N: J1.3 R10.2 U4.3(IN-)  [also labelled M1_V]
1B_ISENS_P: C22.1 Q2.1(S) Q2.2(S) Q2.3(S) Q5.5(D) Q5.6(D) Q5.7(D) Q5.8(D) Q5.9(D) R7.1 R10.1 U2.15(VS2) U4.2(IN+)  [also labelled 1SH_V]
1GH_A: R3.2 U2.19(HO1)
1GH_B: R4.2 U2.16(HO2)
1GH_C: R5.2 U2.13(HO3)
1GL_A: R13.2 U2.11(LO1)
1GL_B: R14.2 U2.10(LO2)
1GL_C: R15.2 U2.9(LO3)
1SH_W: C23.1 J1.2 Q3.1(S) Q3.2(S) Q3.3(S) Q6.5(D) Q6.6(D) Q6.7(D) Q6.8(D) Q6.9(D) R8.1 U2.12(VS3)  [also labelled M1_W]
1VB1: C20.2 D1.1(A) U2.20(VB1)
1VB2: C22.2 D2.1(A) U2.17(VB2)
1VB3: C23.2 D3.1(A) U2.14(VB3)
2A_ISENS: C39.2 R27.2  [also labelled ADC1_IN4]
2A_ISENS_N: J2.3 R25.2 U6.3(IN-)  [also labelled M2_U]
2A_ISENS_P: C35.1 Q7.1(S) Q7.2(S) Q7.3(S) Q10.5(D) Q10.6(D) Q10.7(D) Q10.8(D) Q10.9(D) R22.1 R25.1 U5.18(VS1) U6.2(IN+)  [also labelled 2SH_U]
2B_ISENS: C40.2 R28.2  [also labelled ADC1_IN8]
2B_ISENS_N: J2.1 R26.2 U7.3(IN-)  [also labelled M2_V]
2B_ISENS_P: C37.1 Q8.1(S) Q8.2(S) Q8.3(S) Q11.5(D) Q11.6(D) Q11.7(D) Q11.8(D) Q11.9(D) R23.1 R26.1 U5.15(VS2) U7.2(IN+)  [also labelled 2SH_V]
2GH_A: R19.2 U5.19(HO1)
2GH_B: R20.2 U5.16(HO2)
2GH_C: R21.2 U5.13(HO3)
2GL_A: R29.2 U5.11(LO1)
2GL_B: R30.2 U5.10(LO2)
2GL_C: R31.2 U5.9(LO3)
2SH_W: C38.1 J2.2 Q9.1(S) Q9.2(S) Q9.3(S) Q12.5(D) Q12.6(D) Q12.7(D) Q12.8(D) Q12.9(D) R24.1 U5.12(VS3)  [also labelled M2_W]
2VB1: C35.2 D4.1(A) U5.20(VB1)
2VB2: C37.2 D5.1(A) U5.17(VB2)
2VB3: C38.2 D6.1(A) U5.14(VB3)
EC1_CLK: JP1.4 JP2.4  [also labelled EC2_CLK, EC3_CLK, SPI1_CLK]
EC1_CS: JP1.5  [also labelled PD9]
EC1_MISO: JP1.3 JP2.3  [also labelled EC2_MISO, EC3_MISO, SPI1_MISO]
EC1_MOSI: JP1.2 JP2.2  [also labelled EC2_MOSI, EC3_MOSI, SPI1_MOSI]
EC2_CS: JP2.5  [also labelled PA3]
M1_PWMA: U2.22(HIN1)  [also labelled TIM8_CH1]
M1_PWMA_N: U2.1(LIN1)  [also labelled TIM8_CH1N]
M1_PWMB: U2.23(HIN2)  [also labelled TIM8_CH2]
M1_PWMB_N: U2.2(LIN2)  [also labelled TIM8_CH2N]
M1_PWMC: U2.24(HIN3)  [also labelled TIM8_CH3]
M1_PWMC_N: U2.3(LIN3)  [also labelled TIM8_CH3N]
M2_PWMA: U5.22(HIN1)  [also labelled TIM1_CH1]
M2_PWMA_N: U5.1(LIN1)  [also labelled TIM1_CH1N]
M2_PWMB: U5.23(HIN2)  [also labelled TIM1_CH2]
M2_PWMB_N: U5.2(LIN2)  [also labelled TIM1_CH2N]
M2_PWMC: U5.24(HIN3)  [also labelled TIM1_CH3]
M2_PWMC_N: U5.3(LIN3)  [also labelled TIM1_CH3N]
NetQ1_4: Q1.4(G) R3.1 R6.2
NetQ2_4: Q2.4(G) R4.1 R7.2
NetQ3_4: Q3.4(G) R5.1 R8.2
NetQ4_4: Q4.4(G) R13.1 R16.2
NetQ5_4: Q5.4(G) R14.1 R17.2
NetQ6_4: Q6.4(G) R15.1 R18.2
NetQ7_4: Q7.4(G) R19.1 R22.2
NetQ8_4: Q8.4(G) R20.1 R23.2
NetQ9_4: Q9.4(G) R21.1 R24.2
NetQ10_4: Q10.4(G) R29.1 R32.2
NetQ11_4: Q11.4(G) R30.1 R33.2
NetQ12_4: Q12.4(G) R31.1 R34.2
NetR11_1: R11.1 U3.8(OUT)
NetR12_1: R12.1 U4.8(OUT)
NetR27_1: R27.1 U6.8(OUT)
NetR28_1: R28.1 U7.8(OUT)

Not connected (* = marked no-connect by the designer): J1 4 5; J2 4 5; U2 5(NC) 7(NC) 8(NC) 21(NC) 25(EP); U3 1(NC); U4 1(NC); U5 5(NC) 7(NC) 8(NC) 21(NC) 25(EP); U6 1(NC); U7 1(NC)

### Layout directives
differential pair: 1A_ISENS_N, 1A_ISENS_P, 1B_ISENS_N, 1B_ISENS_P, 2A_ISENS_N, 2A_ISENS_P, 2B_ISENS_N, 2B_ISENS_P

### Notes on the sheet
- Motor1
- Motor2
- (near U8#1) Motor3 -- FPV
- ConnectDef
- M1
- M2
- M3

### Library data of the parts
C13-C40 C41#1 C41#2 C42#1 C42#2 C43#1 C43#2 C44#1 C44#2 C45#1 C45#2 C46#1 C46#2 C47#1 = C: 无极性贴片电容; 版权归属: 源创客; BOM名称: 无极性贴片电容; 学习资源: www.ooocke.com
D1-D6 = 1N5819: 肖特基二极管; 版权归属: 源创客; 属性: 40V/2A; BOM名称: 肖特基二极管; 学习资源: www.ooocke.com
J1 J2 = MR30PW-F: 航模接口
JP1 JP2 = Header 6: 6P接插件; 版权归属: 源创客; BOM名称: 6P接插件; 学习资源: www.ooocke.com
L3 L4 = L: 小功率贴片电感; 版权归属: 源创客; BOM名称: 小功率贴片电感; 学习资源: www.ooocke.com
Q1-Q12 = KNY3303A: N沟道MOS管 / PDFN-8(5.8x4.9)
R3-R34 R35#1 R38#1 = R: 贴片电阻; 版权归属: 源创客; BOM名称: 贴片电阻; 学习资源: www.ooocke.com
R36#1 R37#1 = R-I: 电流检测电阻; 版权归属: 源创客; BOM名称: 电流检测电阻; 学习资源: www.ooocke.com
U2 U5 = FD6288Q: 栅极驱动IC
U3 U4 U6 U7 U9#1 U10#1 = INA240: PWM抑制电流检测芯片
U8#1 = DRV8313: 集成FET的3路半桥驱动器 / 3A

## Sheet Power.SchDoc
size A4; SheetNumber: 4; SheetTotal: 5
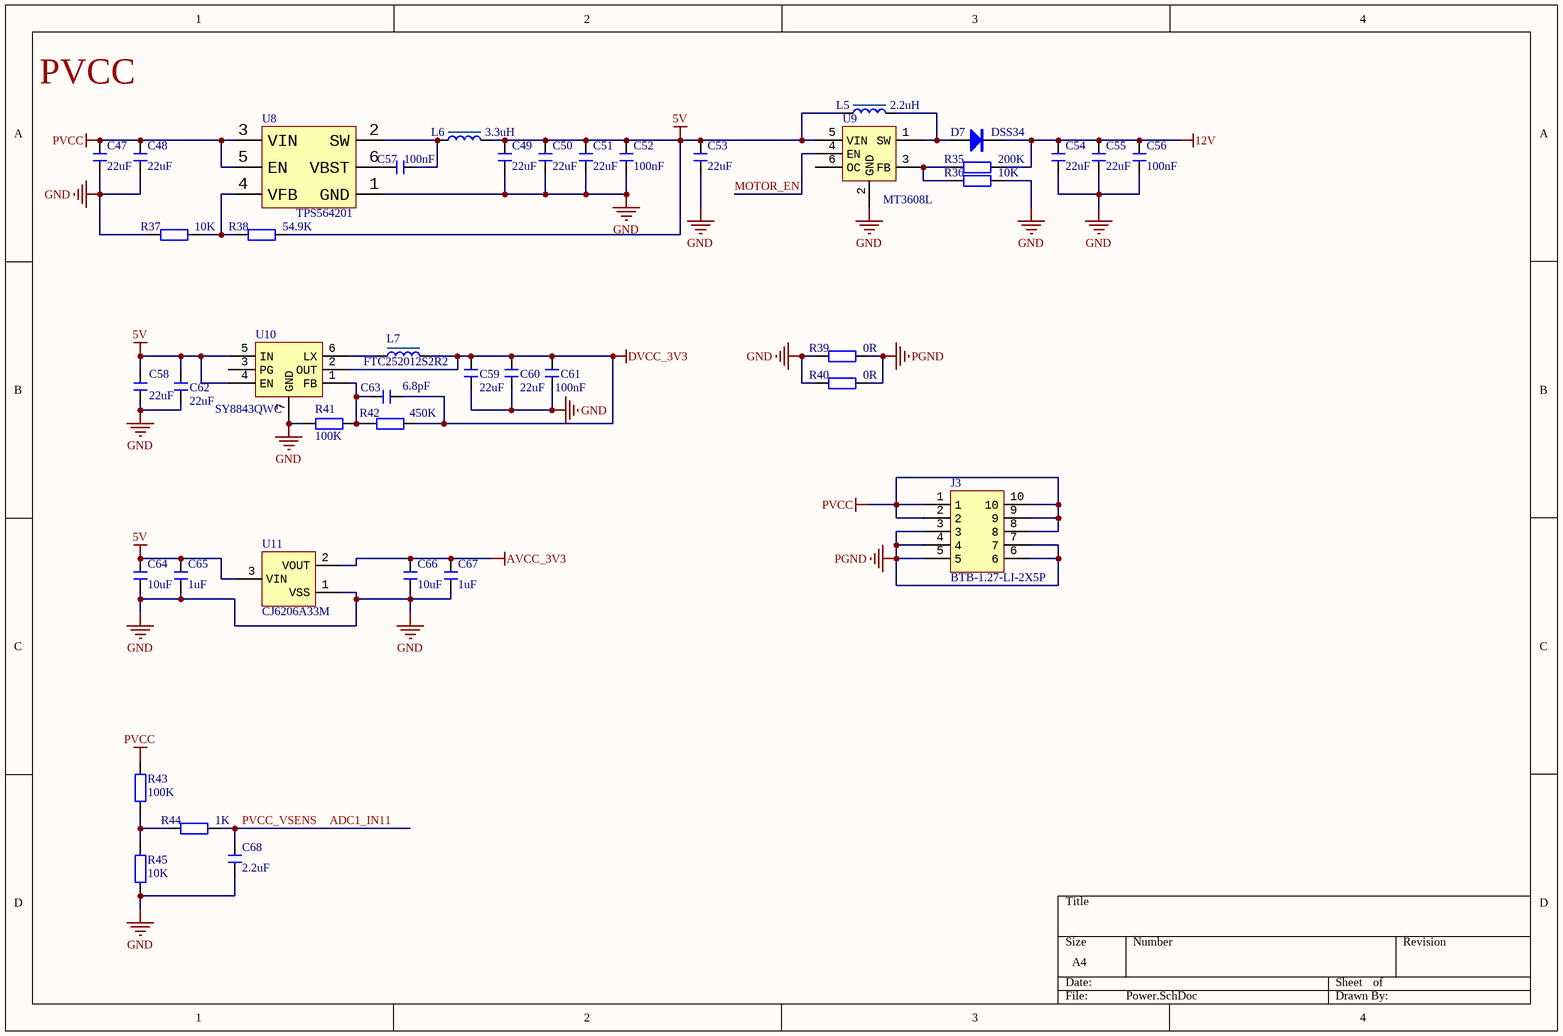
[diagram p3: Power.SchDoc]

### Parts
(Parts that share a designator on the sheet are numbered #1, #2 ... from top to bottom, then left to right.)
C47#2  22uF  [C 1206_L]
C48  22uF  [C 1206_L]
C49  22uF  [C 0603_L]
C50  22uF  [C 0603_L]
C51  22uF  [C 0603_L]
C52  100nF  [C 0402_L]
C53  22uF  [C 0603_L]
C54  22uF  [C 0603_L]
C55  22uF  [C 0603_L]
C56  100nF  [C 0402_L]
C57  100nF  [C 0402_L]
C58  22uF  [C 0603_L]
C59  22uF  [C 0603_L]
C60  22uF  [C 0603_L]
C61  100nF  [C 0402_L]
C62  22uF  [C 0603_L]
C63  6.8pF  [C 0402_L]
C64  10uF  [C 0402_L]
C65  1uF  [C 0402_L]
C66  10uF  [C 0402_L]
C67  1uF  [C 0402_L]
C68  2.2uF  [C 0402_L]
D7  DSS34  [SOD-123FL]
J3  BTB-1.27-LI-2X5P  [1.27-LI-2X5P]
L5  2.2uH  [L-4020]
L6  3.3uH  [L-0630]
L7  FTC252012S2R2  [252012]
R35#2  200K  [R 0402_L]
R36#2  10K  [R 0402_L]
R37#2  10K  [R 0402_L]
R38#2  54.9K  [R 0402_L]
R39  0R  [R 1206_L]
R40  0R  [R 1206_L]
R41  100K  [R 0402_L]
R42  450K  [R 0402_L]
R43  100K  [R 0402_L]
R44  1K  [R 0402_L]
R45  10K  [R 0402_L]
U8#2  TPS564201  [SOT23-6L]
U9#2  MT3608L  [SOT23-6L]
U10#2  SY8843QWC  [QFN7 1.5X1.5]
U11  CJ6206A33M  [SOT23-3L]

### Nets
5V: C49.2 C50.2 C51.2 C52.2 C53.2 C58.2 C62.2 C64.2 C65.2 L5.1 L6.2 R38#2.2 U9#2.5(VIN) U10#2.4(EN) U10#2.5(IN) U11.3(VIN)
12V: C54.2 C55.2 C56.2 D7.1(K) R35#2.2
AVCC_3V3: C66.2 C67.2 U11.2(VOUT)
DVCC_3V3: C59.2 C60.2 C61.2 C63.1 L7.2 R42.1 U10#2.2(OUT)
GND: C47#2.1 C48.1 C49.1 C50.1 C51.1 C52.1 C53.1 C54.1 C55.1 C56.1 C58.1 C59.1 C60.1 C61.1 C62.1 C64.1 C65.1 C66.1 C67.1 C68.1 R36#2.2 R37#2.1 R39.1 R40.1 R41.2 R45.1 U8#2.1(GND) U9#2.2(GND) U10#2.7(GND) U11.1(VSS)
PGND: J3.3 J3.4 J3.5 J3.6 J3.7 R39.2 R40.2
PVCC: C47#2.2 C48.2 J3.1 J3.2 J3.8 J3.9 J3.10 R43.2 U8#2.3(VIN) U8#2.5(EN)
ADC1_IN11: C68.2 R44.1  [also labelled PVCC_VSENS]
MOTOR_EN: U9#2.4(EN)
NetC57_1: C57.1 U8#2.6(VBST)
NetC57_2: C57.2 L6.1 U8#2.2(SW)
NetC63_2: C63.2 R41.1 R42.2 U10#2.1(FB)
NetD7_2: D7.2(A) L5.2 U9#2.1(SW)
NetL7_1: L7.1 U10#2.6(LX)
NetR35#2_1: R35#2.1 R36#2.1 U9#2.3(FB)
NetR37#2_2: R37#2.2 R38#2.1 U8#2.4(VFB)
NetR43_1: R43.1 R44.2 R45.2

Not connected (* = marked no-connect by the designer): U9#2 6(OC); U10#2 3(PG)

### Notes on the sheet
- PVCC

### Library data of the parts
C47#2 C48-C68 = C: 无极性贴片电容; 版权归属: 源创客; BOM名称: 无极性贴片电容; 学习资源: www.ooocke.com
D7 = DSS34: 肖特基二极管
J3 = LI-2X5P
L5-L7 = L-CD: 贴片功率电感; BOM名称: 功率电感; 版权归属: 源创客; 学习资源: www.ooocke.com
R35#2 R36#2 R37#2 R38#2 R39-R45 = R: 贴片电阻; 版权归属: 源创客; BOM名称: 贴片电阻; 学习资源: www.ooocke.com
U8#2 = TPS563200: 3A  4.5V-17V输入 同步
U9#2 = MT3608L: 2.5A 1.5MHZ / 宽输入升压
U10#2 = SY8843QWC: DC-DC 1.5M / VIN:2.7~5.5V 3A
U11 = LN6206PXXX: 三端稳压芯片 / 6V 250mA

## Sheet Peripheral.SchDoc
size A4; SheetNumber: 5; SheetTotal: 5
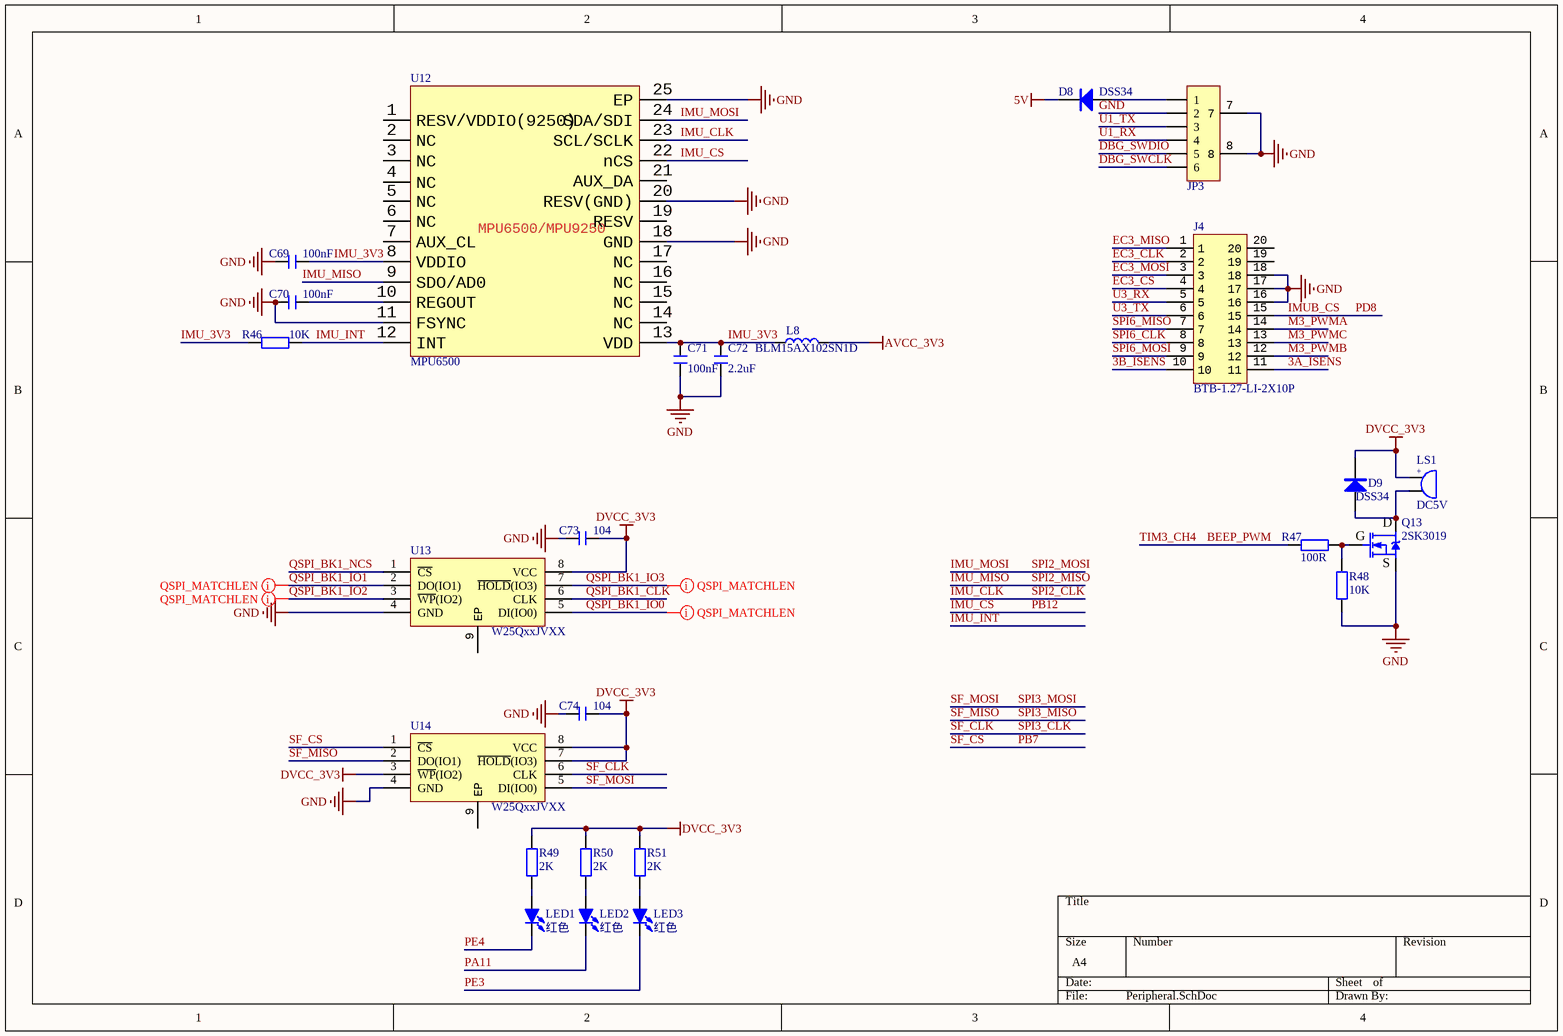
[diagram p4: Peripheral.SchDoc]

### Parts
C69  100nF  [C 0402_L]
C70  100nF  [C 0402_L]
C71  100nF  [C 0402_L]
C72  2.2uF  [C 0402_L]
C73  104  [C 0402_L]
C74  104  [C 0402_L]
D8  DSS34  [SOD-123FL]
D9  DSS34  [SOD-123FL]
J4  BTB-1.27-LI-2X10P  [1.27-LI-2X10P]
JP3  HDR-1X6  [GH1.25-WS-6P]  (value not drawn)
L8  BLM15AX102SN1D  [L 0402]
LED1  红色  [LED 0402R]
LED2  红色  [LED 0402R]
LED3  红色  [LED 0402R]
LS1  DC5V  [BEEP_SMD_SBZ9032C03R16]
Q13  2SK3019  [SOT523]
R46  10K  [R 0402_L]
R47  100R  [R 0402_L]
R48  10K  [R 0402_L]
R49  2K  [R 0402_L]
R50  2K  [R 0402_L]
R51  2K  [R 0402_L]
U12  MPU6500  [QFN24 3X3]
U13  W25QxxJVXX  [SOP8W_L]
U14  W25QxxJVXX  [SOP8W_L]

### Nets
5V: D8.1(K)
AVCC_3V3: L8.2
DVCC_3V3: C73.2 C74.2 D9.1(K) LS1.1 R49.2 R50.2 R51.2 U13.8(VCC) U14.3(~{WP}(IO2)) U14.7(~{HOLD}(IO3)) U14.8(VCC)
GND: C69.2 C70.2 C71.1 C72.1 C73.1 C74.1 J4.16 J4.17 J4.18 JP3.2 JP3.7 JP3.8 Q13.2(S) R48.1 U12.11(FSYNC) U12.18(GND) U12.20(RESV(GND)) U12.25(EP) U13.4(GND) U14.4(GND)
3A_ISENS: J4.11
3B_ISENS: J4.10
BEEP_PWM: R47.1  [also labelled TIM3_CH4]
DBG_SWCLK: JP3.6
DBG_SWDIO: JP3.5
EC3_CLK: J4.2  [project net EC1_CLK]
EC3_CS: J4.4
EC3_MISO: J4.1  [project net EC1_MISO]
EC3_MOSI: J4.3  [project net EC1_MOSI]
IMU_3V3: C69.1 C71.2 C72.2 L8.1 R46.1 U12.8(VDDIO) U12.13(VDD)
IMU_CLK: U12.23(SCL/SCLK)  [also labelled SPI2_CLK]
IMU_CS: U12.22(nCS)  [also labelled PB12]
IMU_INT: R46.2 U12.12(INT)
IMU_MISO: U12.9(SDO/AD0)  [also labelled SPI2_MISO]
IMU_MOSI: U12.24(SDA/SDI)  [also labelled SPI2_MOSI]
IMUB_CS: J4.15  [also labelled PD8]
M3_PWMA: J4.14
M3_PWMB: J4.12
M3_PWMC: J4.13
PA11: LED2.1(K)
PB7: U14.1(~{CS})  [also labelled SF_CS]
PE3: LED3.1(K)
PE4: LED1.1(K)
QSPI_BK1_CLK: U13.6(CLK)
QSPI_BK1_IO0: U13.5(DI(IO0))
QSPI_BK1_IO1: U13.2(DO(IO1))
QSPI_BK1_IO2: U13.3(~{WP}(IO2))
QSPI_BK1_IO3: U13.7(~{HOLD}(IO3))
QSPI_BK1_NCS: U13.1(~{CS})
SF_CLK: U14.6(CLK)  [also labelled SPI3_CLK]
SF_MISO: U14.2(DO(IO1))  [also labelled SPI3_MISO]
SF_MOSI: U14.5(DI(IO0))  [also labelled SPI3_MOSI]
SPI6_CLK: J4.8
SPI6_MISO: J4.7
SPI6_MOSI: J4.9
U1_RX: JP3.4
U1_TX: JP3.3
U3_RX: J4.5
U3_TX: J4.6
NetC70_1: C70.1 U12.10(REGOUT)
NetD8_2: D8.2(A) JP3.1
NetD9_2: D9.2(A) LS1.2 Q13.3(D)
NetLED1_2: LED1.2(A) R49.1
NetLED2_2: LED2.2(A) R50.1
NetLED3_2: LED3.2(A) R51.1
NetQ13_1: Q13.1(G) R47.2 R48.2

Not connected (* = marked no-connect by the designer): J4 19 20; U12 1(RESV/VDDIO(9250)) 2(NC) 3(NC) 4(NC) 5(NC) 6(NC) 7(AUX_CL) 14(NC) 15(NC) 16(NC) 17(NC) 19(RESV) 21(AUX_DA); U13 9(EP); U14 9(EP)

### Layout directives
mark named QSPI_MATCHLEN: QSPI_BK1_IO0, QSPI_BK1_IO1, QSPI_BK1_IO2, QSPI_BK1_IO3

### Notes on the sheet
- (in symbol BEEP) +
- (in symbol MPU6500) MPU6500/MPU9250

### Library data of the parts
C69-C74 = C: 无极性贴片电容; 版权归属: 源创客; BOM名称: 无极性贴片电容; 学习资源: www.ooocke.com
D8 D9 = DSS34: 肖特基二极管
J4 = LI-2X10P
JP3 = Header 6: 6P接插件; 版权归属: 源创客; BOM名称: 6P接插件; 学习资源: www.ooocke.com
L8 = L: 小功率贴片电感; 版权归属: 源创客; BOM名称: 小功率贴片电感; 学习资源: www.ooocke.com
LED1-LED3 = LED-SMD: 贴片LED; 版权归属: 源创客; BOM名称: 贴片LED; 学习资源: www.ooocke.com
LS1 = BEEP: 蜂鸣器; 版权归属: 源创客; BOM名称: 蜂鸣器; 学习资源: www.ooocke.com
Q13 = 2SK3019: N沟道场效应管
R46-R51 = R: 贴片电阻; 版权归属: 源创客; BOM名称: 贴片电阻; 学习资源: www.ooocke.com
U12 = MPU6500: 6轴IMU
U13 U14 = W25Qxx: 外置Flash; 版权归属: 源创客; BOM名称: 外置Flash; 学习资源: www.ooocke.com

## Nets that join several sheets
5V: Power (16 pins), Peripheral (D8.1)
12V: Motor (10 pins), Power (5 pins)
AVCC_3V3: MCU_B (L1.2 L2.2), Motor (6 pins), Power (C66.2 C67.2 U11.2), Peripheral (L8.2)
DVCC_3V3: MCU_B (12 pins), Power (7 pins), Peripheral (11 pins)
GND: MCU_B (21 pins), Motor (32 pins), Power (30 pins), Peripheral (20 pins)
PGND: Motor (36 pins), Power (7 pins)
PVCC: Motor (42 pins), Power (10 pins)
1A_ISENS: MCU_A (U1.35), Motor (C24.2 R11.2)
1B_ISENS: MCU_A (U1.34), Motor (C25.2 R12.2)
2A_ISENS: MCU_A (U1.32), Motor (C39.2 R27.2)
2B_ISENS: MCU_A (U1.33), Motor (C40.2 R28.2)
3A_ISENS: MCU_A (U1.31), Peripheral (J4.11)
3B_ISENS: MCU_A (U1.15), Peripheral (J4.10)
ADC1_IN11: MCU_A (U1.16), Power (C68.2 R44.1)
BEEP_PWM: MCU_A (U1.66), Peripheral (R47.1)
DBG_SWCLK: MCU_A (U1.76), Peripheral (JP3.6)
DBG_SWDIO: MCU_A (U1.72), Peripheral (JP3.5)
EC1_CLK: MCU_A (U1.89), Motor (JP1.4 JP2.4), Peripheral (J4.2)
EC1_CS: MCU_B (U1.56), Motor (JP1.5)
EC1_MISO: MCU_A (U1.90), Motor (JP1.3 JP2.3), Peripheral (J4.1)
EC1_MOSI: MCU_B (U1.88), Motor (JP1.2 JP2.2), Peripheral (J4.3)
EC2_CS: MCU_A (U1.25), Motor (JP2.5)
EC3_CS: MCU_B (U1.57), Peripheral (J4.4)
IMU_CLK: MCU_A (U1.52), Peripheral (U12.23)
IMU_CS: MCU_A (U1.51), Peripheral (U12.22)
IMU_MISO: MCU_A (U1.17), Peripheral (U12.9)
IMU_MOSI: MCU_A (U1.18), Peripheral (U12.24)
IMUB_CS: MCU_B (U1.55), Peripheral (J4.15)
M1_PWMA: MCU_A (U1.63), Motor (U2.22)
M1_PWMA_N: MCU_A (U1.29), Motor (U2.1)
M1_PWMB: MCU_A (U1.64), Motor (U2.23)
M1_PWMB_N: MCU_A (U1.53), Motor (U2.2)
M1_PWMC: MCU_A (U1.65), Motor (U2.24)
M1_PWMC_N: MCU_A (U1.54), Motor (U2.3)
M2_PWMA: MCU_B (U1.39), Motor (U5.22)
M2_PWMA_N: MCU_B (U1.38), Motor (U5.1)
M2_PWMB: MCU_B (U1.41), Motor (U5.23)
M2_PWMB_N: MCU_B (U1.40), Motor (U5.2)
M2_PWMC: MCU_B (U1.43), Motor (U5.24)
M2_PWMC_N: MCU_B (U1.42), Motor (U5.3)
M3_PWMA: MCU_A (U1.22), Peripheral (J4.14)
M3_PWMB: MCU_A (U1.23), Peripheral (J4.12)
M3_PWMC: MCU_A (U1.24), Peripheral (J4.13)
MOTOR_EN: MCU_A (U1.28), Power (U9#2.4)
PA11: MCU_A (U1.70), Peripheral (LED2.1)
PB7: MCU_A (U1.93), Peripheral (U14.1)
PE3: MCU_B (U1.2), Peripheral (LED3.1)
PE4: MCU_B (U1.3), Peripheral (LED1.1)
QSPI_BK1_CLK: MCU_A (U1.36), Peripheral (U13.6)
QSPI_BK1_IO0: MCU_B (U1.58), Peripheral (U13.5)
QSPI_BK1_IO1: MCU_B (U1.59), Peripheral (U13.2)
QSPI_BK1_IO2: MCU_B (U1.1), Peripheral (U13.3)
QSPI_BK1_IO3: MCU_B (U1.60), Peripheral (U13.7)
QSPI_BK1_NCS: MCU_A (U1.92), Peripheral (U13.1)
SF_CLK: MCU_A (U1.78), Peripheral (U14.6)
SF_MISO: MCU_A (U1.79), Peripheral (U14.2)
SF_MOSI: MCU_B (U1.87), Peripheral (U14.5)
SPI6_CLK: MCU_A (U1.80), Peripheral (J4.8)
SPI6_MISO: MCU_A (U1.30), Peripheral (J4.7)
SPI6_MOSI: MCU_A (U1.91), Peripheral (J4.9)
U1_RX: MCU_A (U1.69), Peripheral (JP3.4)
U1_TX: MCU_A (U1.68), Peripheral (JP3.3)
U3_RX: MCU_A (U1.47), Peripheral (J4.5)
U3_TX: MCU_A (U1.46), Peripheral (J4.6)